# EAGLE schematic TH (EAGLE 7.5.0)
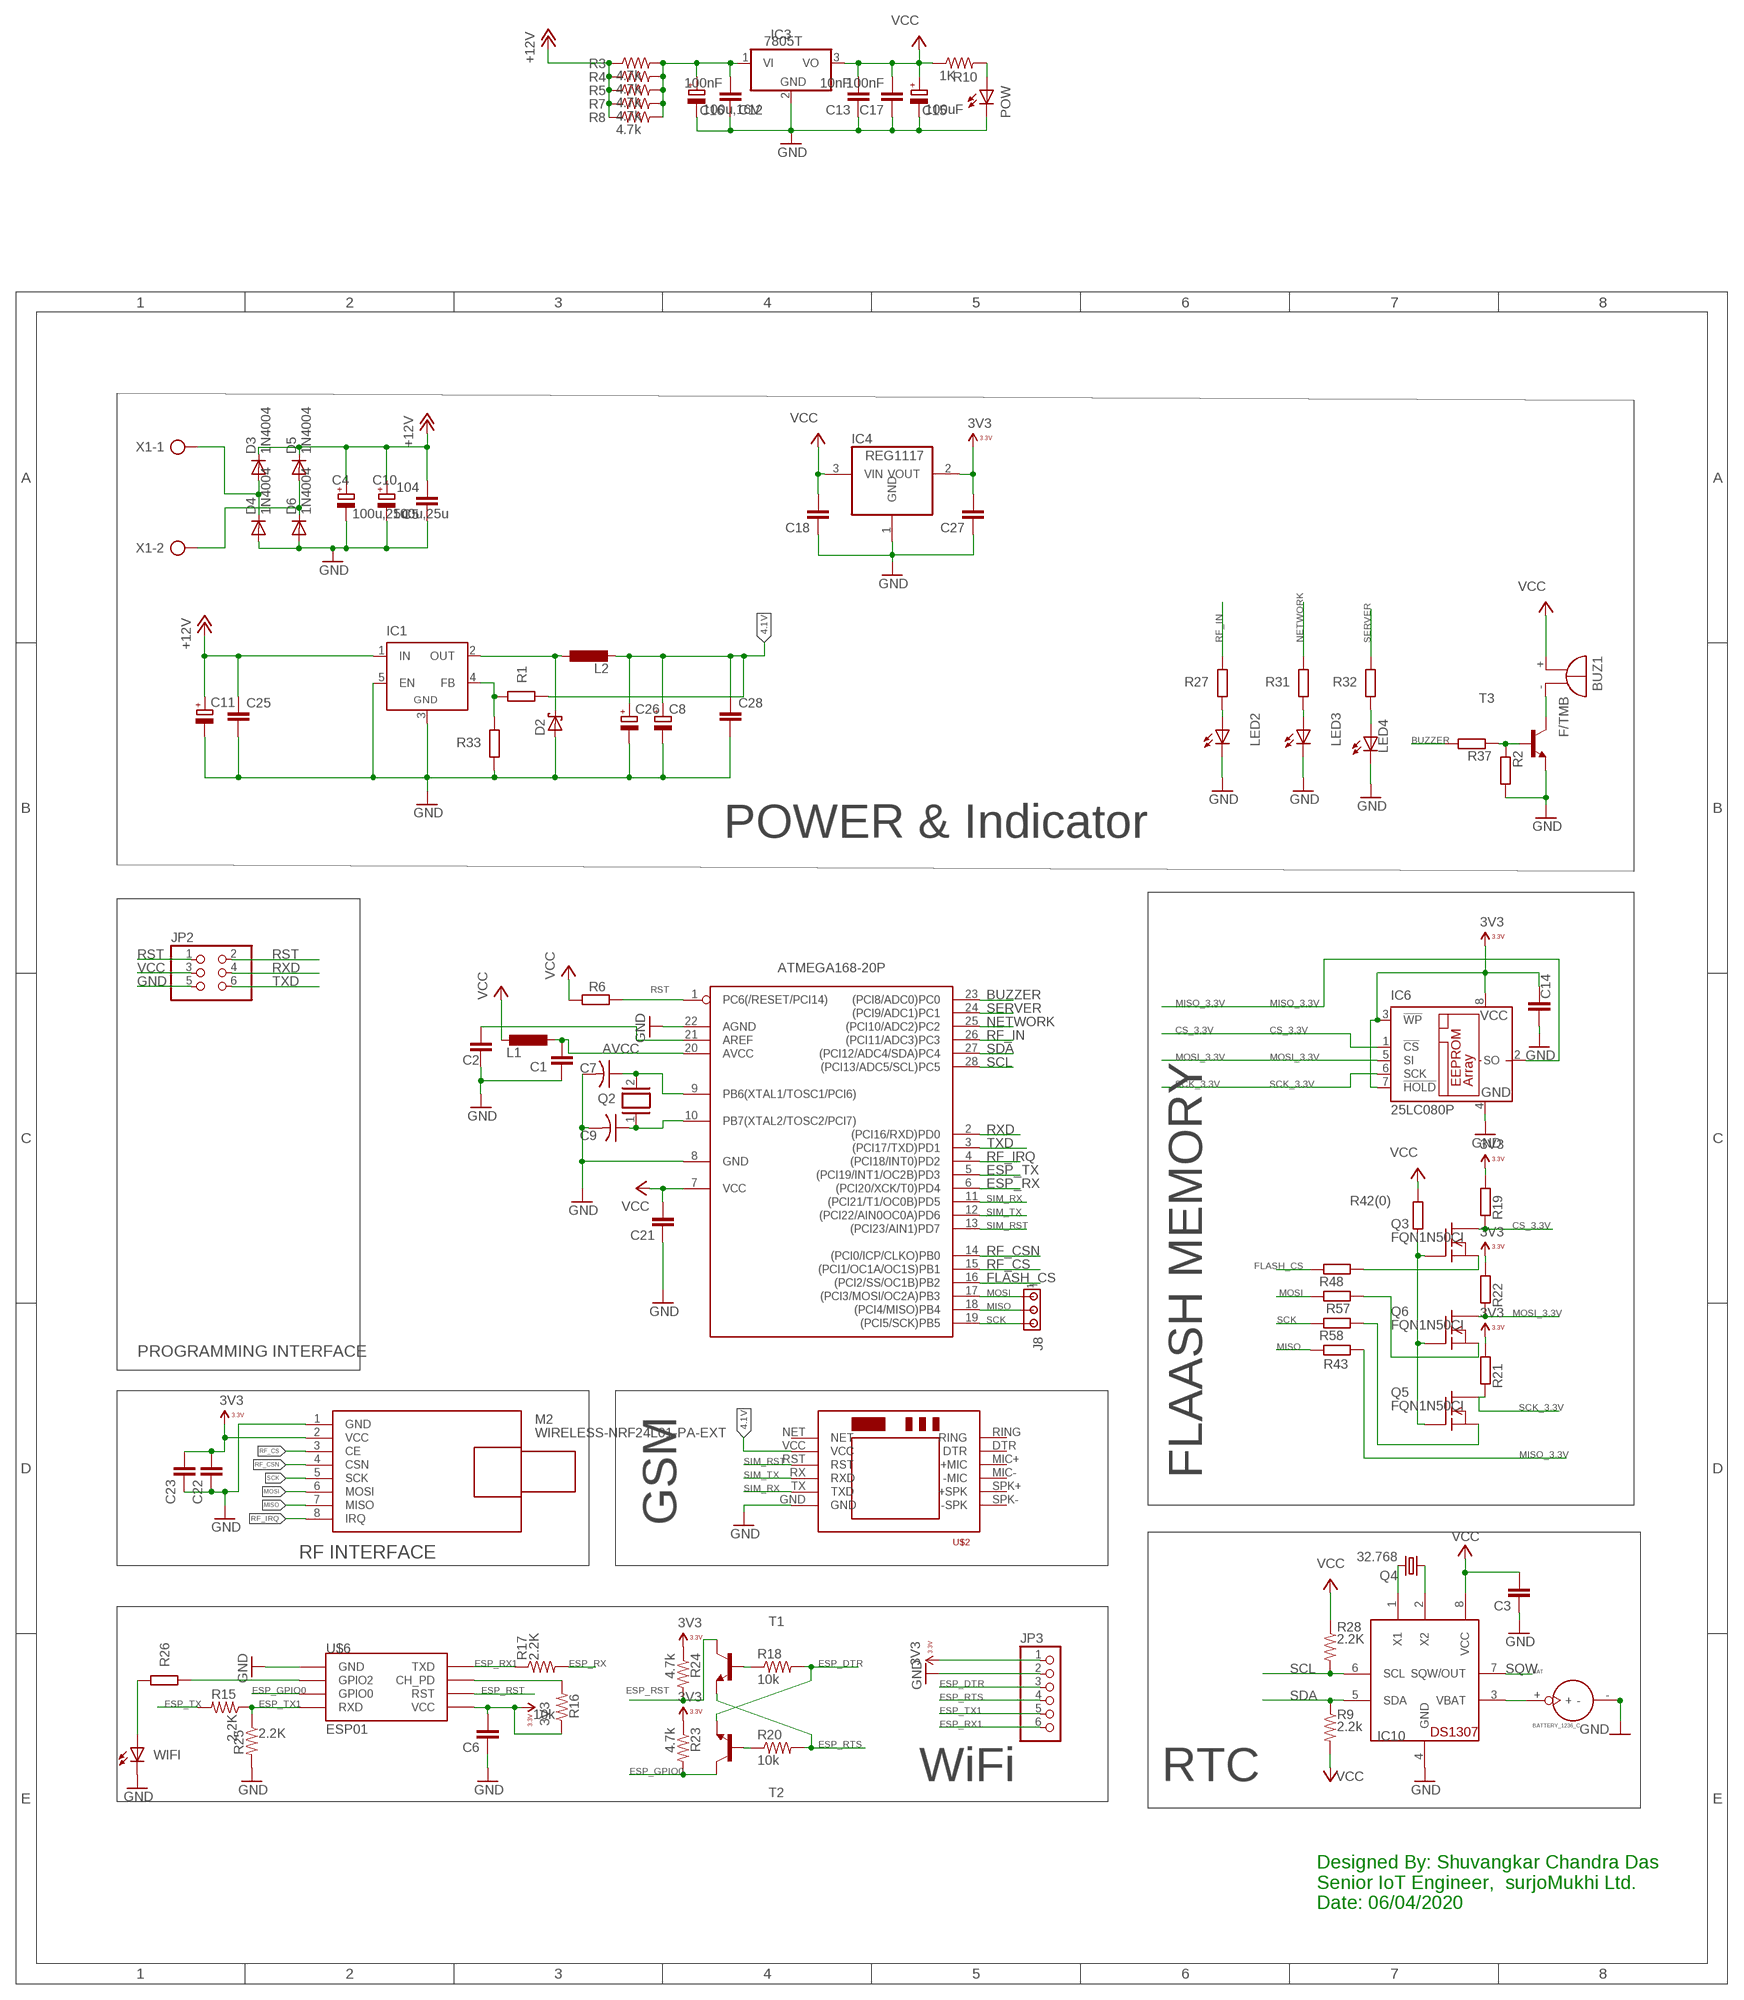
[diagram p0: schematic, sheet 1]

## Parts
BAT  BATTERY_1236_C  [BATTERY_1236_C]
BUZ1  F/TMB  [F/TMB]
C1  C-EU050-024X044  [C050-024X044]
C2  C-EU025-025X050  [C025-025X050]
C3  C-EU050-024X044  [C050-024X044]
C4  100u,25u  CPOL-EUE3.5-10  [E3,5-10]
C5  104  C-EU050-024X044  [C050-024X044]
C6  C-EU050-024X044  [C050-024X044]
C7  C-US050-024X044  [C050-024X044]
C8  CPOL-EUE2.5-7  [E2,5-7]
C9  C-US050-024X044  [C050-024X044]
C10  100u,25u  CPOL-EUE3.5-10  [E3,5-10]
C11  CPOL-EUE2.5-7  [E2,5-7]
C12  100nF  C-EU050-024X044  [C050-024X044]
C13  10nF  C-EU050-024X044  [C050-024X044]
C14  C-EU050-024X044  [C050-024X044]
C15  100uF  CPOL-EUTT2D6  [TT2D6]
C16  100u,16V  CPOL-EUTT2D6  [TT2D6]
C17  100nF  C-EU050-024X044  [C050-024X044]
C18  C-EU050-024X044  [C050-024X044]
C21  C-EU050-024X044  [C050-024X044]
C22  C-EU050-024X044  [C050-024X044]
C23  C-EU050-024X044  [C050-024X044]
C25  C-EU050-024X044  [C050-024X044]
C26  CPOL-EUE2.5-7  [E2,5-7]
C27  C-EU050-024X044  [C050-024X044]
C28  C-EU050-024X044  [C050-024X044]
D2  SCHOTTKY-DIODEDO41  [DO41-10]
D3  1N4004  [DO41-10]
D4  1N4004  [DO41-10]
D5  1N4004  [DO41-10]
D6  1N4004  [DO41-10]
IC1  LM2596TH  [TO220-52]
IC3  7805T  [TO220H]
IC4  REG1117  [SOT223]
IC6  25LC080P  [DIL8]
IC7  ATMEGA168-20P  [DIL28-3]
IC10  DS1307  [DIL08]
J8  MTA03-100  [10X03MTA]
JP2  PINHD-2X3  [2X03]
JP3  PINHD-1X6  [1X06]
L1  L-EU0207/15  [0207/15]
L2  L-EU0207/10  [0207/10]
LED2  LED3MM  [LED3MM]
LED3  LED3MM  [LED3MM]
LED4  LED3MM  [LED3MM]
M2  WIRELESS-NRF24L01-PA-EXT  [WIRELESS-NRF24L01-PA-EXT]
POW  LED3MM  [LED3MM]
Q2  XTAL/S  [QS]
Q3  FQN1N50CI  [TO92-INLINE]
Q4  32.768  CRYTALTC38H  [TC38H]
Q5  FQN1N50CI  [TO92-INLINE]
Q6  FQN1N50CI  [TO92-INLINE]
R1  R-EU_0204/7  [0204/7]
R2  R-EU_0204/7  [0204/7]
R3  4.7k  R-US_0204/7  [0204/7]
R4  4.7k  R-US_0204/7  [0204/7]
R5  4.7k  R-US_0204/7  [0204/7]
R6  R-EU_0204/7  [0204/7]
R7  4.7k  R-US_0204/7  [0204/7]
R8  4.7k  R-US_0204/7  [0204/7]
R9  2.2k  R-US_0204/7  [0204/7]
R10  1K  R-US_0204/7  [0204/7]
R15  2.2K  R-US_0204/7  [0204/7]
R16  10k  R-US_0204/7  [0204/7]
R17  2.2K  R-US_0204/7  [0204/7]
R18  10k  R-US_0204/7  [0204/7]
R19  R-EU_0204/7  [0204/7]
R20  10k  R-US_0204/7  [0204/7]
R21  R-EU_0204/7  [0204/7]
R22  R-EU_0204/7  [0204/7]
R23  4.7k  R-US_0204/7  [0204/7]
R24  4.7k  R-US_0204/7  [0204/7]
R25  2.2K  R-US_0204/7  [0204/7]
R26  R-EU_0204/7  [0204/7]
R27  R-EU_0207/10  [0207/10]
R28  2.2K  R-US_0204/7  [0204/7]
R31  R-EU_0207/10  [0207/10]
R32  R-EU_0207/10  [0207/10]
R33  R-EU_0204/7  [0204/7]
R37  R-EU_0204/7  [0204/7]
R42(0)  R-EU_0207/10  [0207/10]
R43  R-EU_0207/10  [0207/10]
R48  R-EU_0207/10  [0207/10]
R57  R-EU_0207/10  [0207/10]
R58  R-EU_0207/10  [0207/10]
T1  BC547-NPN-TO92-CBE  [TO92-CBE]
T2  BC547-NPN-TO92-CBE  [TO92-CBE]
T3  BC547A-NPN-TO92-CBE  [TO92-CBE]
U$2  SIM800LMODULE  [SIM800LMODULE]
U$6  ESP01  [ESP01]
WIFI  LED3MM  [LED3MM]
X1  AK500/2  [AK500/2]

## Nets
3V3: C6.2 C14.2 C22.2 C23.2 C27.2 IC4.2(VOUT) IC6.3(!WP) IC6.7(!HOLD) IC6.8(VCC) JP3.1 M2.2(VCC) R16.1 R19.2 R21.2 R22.2 R23.1 R24.1 U$6.VCC
4.1V: C8.+ C26.+ C28.1 L2.2 R1.2 U$2.VCC
+12V: C4.+ C5.2 C10.+ C11.+ C25.1 D3.C D5.C IC1.1(IN) R3.1 R4.1 R5.1 R7.1 R8.1
AVCC: C1.2 IC7.20(AVCC) L1.2
BUZZER: IC7.23((PCI8/ADC0)PC0) R37.2
CS_3.3V: IC6.1(!CS) Q3.1(D) R19.1
ESP_DTR: JP3.3 R18.2 T2.E
ESP_GPIO0: R23.2 T2.C U$6.GPIO0
ESP_RST: R24.2 T1.C U$6.RST
ESP_RTS: JP3.4 R20.2 T1.E
ESP_RX: IC7.6((PCI20/XCK/T0)PD4) R17.2
ESP_RX1: JP3.6 R17.1 U$6.TX(TXD)
ESP_TX: IC7.5((PCI19/INT1/OC2B)PD3) R15.2
ESP_TX1: JP3.5 R15.1 R25.1 U$6.RX(RXD)
FLASH_CS: IC7.16((PCI2/SS/OC1B)PB2) R48.1
GND: BAT.- C1.1 C2.1 C3.1 C4.- C5.1 C6.1 C7.2 C8.- C9.2 C10.- C11.- C12.1 C13.1 C14.1 C15.- C16.- C17.1 C18.1 C21.1 C22.1 C23.1 C25.2 C26.- C27.1 C28.2 D2.A D4.A D6.A IC1.3(GND) IC1.5(EN) IC3.2(GND) IC4.1(GND) IC6.4(GND) IC7.8(GND) IC7.22(AGND) IC10.4(GND) JP2.5 JP3.2 LED2.K(C) LED3.K(C) LED4.K(C) M2.1(GND) POW.K(C) R2.2 R25.2 R33.1 T3.E U$2.GND U$6.GND WIFI.K(C)
MISO: IC7.18((PCI4/MISO)PB4) J8.2 M2.7(MISO) R43.2
MISO_3.3V: IC6.2(SO) R43.1
MOSI: IC7.17((PCI3/MOSI/OC2A)PB3) J8.1 M2.6(MOSI) Q6.3(S) R57.1 R57.2
MOSI_3.3V: IC6.5(SI) Q6.1(D) R22.1
N$1: C12.2 C16.+ IC3.1(VI) R3.2 R4.2 R5.2 R7.2 R8.2
N$2: POW.A R10.2
N$4: C2.2 IC7.21(AREF)
N$6: D2.C IC1.2(OUT) L2.1
N$7: IC1.4(FB) R1.1 R33.2
N$9: R20.1 T2.B
N$11: R18.1 T1.B
N$12: LED2.A R27.1
N$13: R16.2 U$6.CH_PD
N$15: LED3.A R31.1
N$16: R26.2 U$6.GPIO2
N$20: BUZ1.- T3.C
N$21: C7.1 IC7.9(PB6(XTAL1/TOSC1/PCI6)) Q2.2
N$22: C9.1 IC7.10(PB7(XTAL2/TOSC2/PCI7)) Q2.1
N$25: LED4.A R32.1
N$26: R26.1 WIFI.A
N$29: R2.1 R37.1 T3.B
N$32: D3.A D4.C X1.1
N$33: D5.A D6.C X1.2
N$46: Q3.2(G) Q5.2(G) Q6.2(G) R42(0).1
N$50: IC10.1(X1) Q4.2
N$51: IC10.2(X2) Q4.1
N$52: BAT.+ IC10.3(VBAT)
NETWORK: IC7.25((PCI10/ADC2)PC2) R31.2
RF_CS: IC7.15((PCI1/OC1A/OC1S)PB1) M2.3(CE)
RF_CSN: IC7.14((PCI0/ICP/CLKO)PB0) M2.4(CSN)
RF_IN: IC7.26((PCI11/ADC3)PC3) R27.2
RF_IRQ: IC7.4((PCI18/INT0)PD2) M2.8(IRQ)
RST: IC7.1(PC6(/RESET/PCI14)) JP2.1 JP2.2 R6.1
RXD: IC7.2((PCI16/RXD)PD0) JP2.4
SCK: IC7.19((PCI5/SCK)PB5) J8.3 M2.5(SCK) Q5.3(S) R58.1 R58.2
SCK_3.3V: IC6.6(SCK) Q5.1(D) R21.1
SCL: IC7.28((PCI13/ADC5/SCL)PC5) IC10.6(SCL) R28.2
SD_CS: Q3.3(S) R48.2
SDA: IC7.27((PCI12/ADC4/SDA)PC4) IC10.5(SDA) R9.1
SERVER: IC7.24((PCI9/ADC1)PC1) R32.2
SIM_RST: IC7.13((PCI23/AIN1)PD7) U$2.RST
SIM_RX: IC7.11((PCI21/T1/OC0B)PD5) U$2.TX(TXD)
SIM_TX: IC7.12((PCI22/AIN0OC0A)PD6) U$2.RX(RXD)
SQW: IC10.7(SQW/OUT)
TXD: IC7.3((PCI17/TXD)PD1) JP2.6
VCC: BUZ1.+ C3.2 C13.2 C15.+ C17.2 C18.2 C21.2 IC3.3(VO) IC4.3(VIN) IC7.7(VCC) IC10.8(VCC) JP2.3 L1.1 R6.2 R9.2 R10.1 R28.1 R42(0).2
Unconnected: U$2.DTR U$2.MIC+(+MIC) U$2.MIC-(-MIC) U$2.NET U$2.RING U$2.SPK+(+SPK) U$2.SPK-(-SPK)

## Notes on the sheet
- POWER & Indicator
- PROGRAMMING INTERFACE
- FLAASH MEMORY
- GSM
- RF INTERFACE
- WiFi | RTC
- Designed By: Shuvangkar Chandra Das
  Senior IoT Engineer,  surjoMukhi Ltd.
  Date: 06/04/2020

## Library data of the parts
BAT = Itead_BP_110825.lbr:BATTERY_1236_C: SOC004
BUZ1 = buzzer:F/TMB: BUZZER Source: Buerklin; OC_FARNELL: unknown; OC_NEWARK: unknown
C1-C3 C5 C6 C12-C14 C17 C18 C21-C23 C27 = rcl:C-EU: CAPACITOR, European symbol
C4 C10 C15 C16 = rcl:CPOL-EU: POLARIZED CAPACITOR, European symbol
C7 C9 = adafruit:C-US: CAPACITOR, American symbol
C8 C11 C26 = resistor:CPOL-EU: POLARIZED CAPACITOR, European symbol
C25 C28 = resistor:C-EU: CAPACITOR, European symbol
D2 = adafruit:SCHOTTKY-DIODE: Schottky Diode
D3-D6 = adafruit:1N4004: DIODE General purpose 1N400x type rectifier (With bigger pads) http://www.ladyada.net/library/pcb/eaglelibrary.html
IC1 = linear:LM2596T: STEP-DOWN VOLTAGE REGULATOR
IC3 = linear:78*: Positive VOLTAGE REGULATOR Source: http://cache.national.com/ds/LM/LM78L05.pdf http://www.fairchildsemi.com/ds/LM/LM7805.pdf
IC4 = burr-brown:REG1117: 800mA and 1A Low Dropout (LDO) Positive Regulator 1.8V, 2.5V, 2.85V, 3.3V, 5V, and Adj; MPN: REG1117; OC_FARNELL: 1097566; OC_NEWARK: 14P6981
IC6 = microchip:25*: Serial EEPROM 4K/ 8K , SPI bus; MF: MICROCHIP; MPN: 25LC080/P; OC_FARNELL: 1556143; OC_NEWARK: 92C7440
IC7 = adafruit:ATMEGA168*P: MICROCONTROLLER 16 kBytes FLASH 1 kBytes SRAM 512 Bytes EEPROM USART 8-channel 10 bit ADC
IC10 = adafruit:DS1307: DS1307 Real time clock (RTC) with battery backup ability. Talk to it via i2c
J8 = con-amp:MTA03-100: AMP connector
JP2 = pinhead:PINHD-2X3: PIN HEADER
JP3 = pinhead:PINHD-1X6: PIN HEADER
L1 L2 = rcl:L-EU: INDUCTOR, European symbol
LED2-LED4 POW WIFI = led:LED: LED OSRAM: - CHIPLED LG R971, LG N971, LY N971, LG Q971, LY Q971, LO R971, LY R971 LH N974, LH R974 LS Q976, LO Q976, LY Q976 LO Q996 - Hyper CHIPLED LW Q18S LB Q993, LB Q99A, LB R99A - SideLED LS A670, LO A670, LY A670, LG A670, LP A670 LB A673, LV A673, LT A673, LW A673 LH A674 LY A675 LS A676, LA A676, LO A676, LY A676, LW A676 LS A679, LY A679, LG A679 - Hyper Micro SIDELED® LS Y876, LA Y876, LO Y876, LY Y876 LT Y87S - SmartLED LW L88C, LW L88S LB L89C, LB L89S, LG L890 LS L89K, LO L89K, LY L89K LS L896, LA L896, LO L896, LY L896 - TOPLED LS T670, LO T670, LY T670, LG T670, LP T670 LSG T670, LSP T670, LSY T670, LOP T670, LYG T670 LG T671, LOG T671, LSG T671 LB T673, LV T673, LT T673, LW T673 LH T674 LS T676, LA T676, LO T676, LY T676, LB T676, LH T676, LSB T676, LW T676 LB T67C, LV T67C, LT T67C, LS T67K, LO T67K, LY T67K, LW E67C LS E67B, LA E67B, LO E67B, LY E67B, LB E67C, LV E67C, LT E67C LW T67C LS T679, LY T679, LG T679 LS T770, LO T770, LY T770, LG T770, LP T770 LB T773, LV T773, LT T773, LW T773 LH T774 LS E675, LA E675, LY E675, LS T675 LS T776, LA T776, LO T776, LY T776, LB T776 LHGB T686 LT T68C, LB T68C - Hyper Mini TOPLED® LB M676 - Mini TOPLED Santana® LG M470 LS M47K, LO M47K, LY M47K Source: http://www.osram.convergy.de LUXEON: - LUMILED® LXK2-PW12-R00, LXK2-PW12-S00, LXK2-PW14-U00, LXK2-PW14-V00 LXK2-PM12-R00, LXK2-PM12-S00, LXK2-PM14-U00 LXK2-PE12-Q00, LXK2-PE12-R00, LXK2-PE12-S00, LXK2-PE14-T00, LXK2-PE14-U00 LXK2-PB12-K00, LXK2-PB12-L00, LXK2-PB12-M00, LXK2-PB14-N00, LXK2-PB14-P00, LXK2-PB14-Q00 LXK2-PR12-L00, LXK2-PR12-M00, LXK2-PR14-Q00, LXK2-PR14-R00 LXK2-PD12-Q00, LXK2-PD12-R00, LXK2-PD12-S00 LXK2-PH12-R00, LXK2-PH12-S00 LXK2-PL12-P00, LXK2-PL12-Q00, LXK2-PL12-R00 Source: www.luxeon.com KINGBRIGHT: KA-3528ASYC Source: www.kingbright.com
M2 = diy-modules:WIRELESS-NRF24L01-PA-EXT: 2.4 GHz Wireless Module based on NRF24L01 chip with preamplifier and external antenna Click here to find device on ebay.com <http://www.ebay.com/sch/nrf24l01+pa+lna+sma>
Q2 = special:XTAL/S: CRYSTAL
Q3 Q5 Q6 = adafruit:FQN1N50C: N-Channel Enhancement MOSFET 500V, 0.4A, 6.0 Ohm
Q4 = crystal:CRYTAL: CRYSTAL
R1 R2 R6 R19 R21 R22 R26 R27 R31-R33 R37 R42(0) R43 R48 R57 R58 = rcl:R-EU_: RESISTOR, European symbol
R3-R5 R7-R10 R15-R18 R20 R23-R25 R28 = adafruit:R-US_: RESISTOR, American symbol
T1-T3 = transistor:*-NPN-: NPN Transistror BF959 corrected 2008.03.06
U$2 = SIM800LMODULE:SIM800LMODULE: SIM800L Module
U$6 = PatternAgents_RFmodules:ESP01: ESP8266 Wifi module 01
X1 = con-ptr500:AK500/2: CONNECTOR; OC_FARNELL: unknown; OC_NEWARK: unknown